# Altium project SPEC_A7_Management.PrjPcb (part 1 of 2)
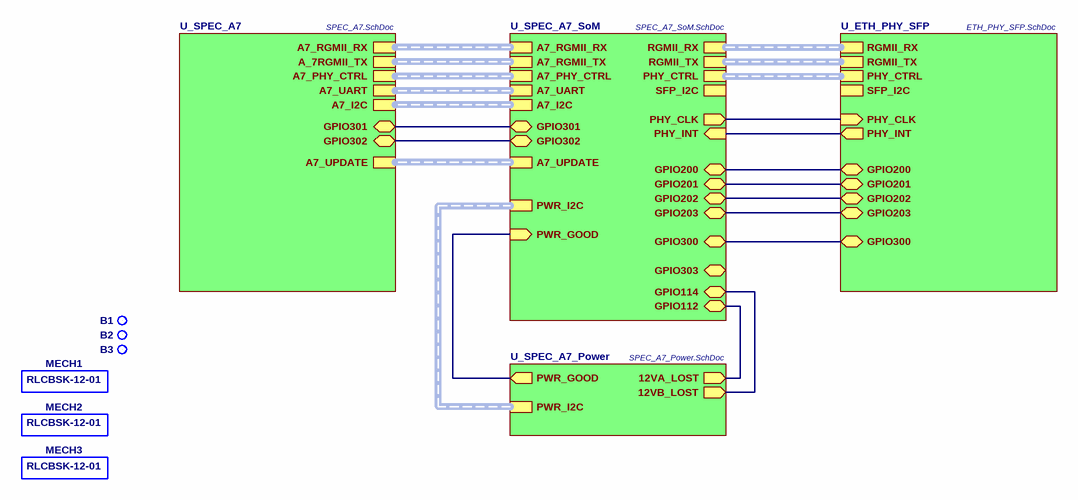
[diagram p0: SPEC_A7_Managment-TOP.SchDoc]
Project: Spec7; Title: Clocker; Title2: Spec7 Managment Unit; Version: v1.0
5 sheets, 180 parts. Net scope: hierarchical (ports join the sheet entries above them; power ports are global).
Board file: SPEC_A7_Management.PCBDOC
Sheets:
  SPEC_A7_Managment-TOP.SchDoc
    U_ETH_PHY_SFP = ETH_PHY_SFP.SchDoc
    U_SPEC_A7 = SPEC_A7.SchDoc
    U_SPEC_A7_Power = SPEC_A7_Power.SchDoc
    U_SPEC_A7_SoM = SPEC_A7_SoM.SchDoc

## Sheet SPEC_A7_Managment-TOP.SchDoc: Clocker
size 420 x 297 mm; DrawnBy: A.B.; Organization: Wydział Elektroniki i Technik Informacyjnych; Address1: ul. Nowowiejska 15/19; Address2: 00-665 Warszawa; Address3: NSW; Address4: Polska; Revision: 0; SheetNumber: 1; SheetTotal: 5; CreateDate: 20/06/2024; Designer: A.B.; Projet: Spec7; CheckedDate: -; ModifiedBy: -

### Parts
B1  Non Plated Hole  [MTG400]  (value not drawn)  (no BOM)
B2  Non Plated Hole  [MTG400]  (value not drawn)  (no BOM)
B3  Non Plated Hole  [MTG400]  (value not drawn)  (no BOM)
MECH1  RLCBSK-12-01  [GENERIC_MECH]
MECH2  RLCBSK-12-01  [GENERIC_MECH]
MECH3  RLCBSK-12-01  [GENERIC_MECH]

### Sub-sheets
U_ETH_PHY_SFP = ETH_PHY_SFP.SchDoc: RGMII_RX (harness RGMII), RGMII_TX (harness RGMII), PHY_CTRL (harness PHY_CTRL), PHY_CLK (in), SFP_I2C (harness I2C), PHY_INT (out), GPIO200 (bidir), GPIO203 (bidir), GPIO201 (bidir), GPIO300 (bidir), GPIO202 (bidir)
U_SPEC_A7 = SPEC_A7.SchDoc: A7_RGMII_RX (harness RGMII), A_7RGMII_TX (harness RGMII), A7_PHY_CTRL (harness PHY_CTRL), A7_I2C (harness I2C), A7_UART (harness UART), GPIO302 (bidir), GPIO301 (bidir), A7_UPDATE (harness FPGA_UPDATE)
U_SPEC_A7_Power = SPEC_A7_Power.SchDoc: PWR_I2C (harness I2C), PWR_GOOD (out), 12VA_LOST (out), 12VB_LOST (out)
U_SPEC_A7_SoM = SPEC_A7_SoM.SchDoc: RGMII_RX (harness RGMII), RGMII_TX (harness RGMII), PHY_CTRL (harness PHY_CTRL), A7_RGMII_RX (harness RGMII), A7_RGMII_TX (harness RGMII), A7_PHY_CTRL (harness PHY_CTRL), PHY_CLK (out), PHY_INT (in), SFP_I2C (harness I2C), PWR_I2C (harness I2C), A7_I2C (harness I2C), A7_UART (harness UART), PWR_GOOD (in), GPIO302 (bidir), GPIO200 (bidir), GPIO303 (bidir), GPIO203 (bidir), GPIO202 (bidir), GPIO201 (bidir), GPIO301 (bidir), GPIO300 (bidir), A7_UPDATE (harness FPGA_UPDATE), GPIO114 (bidir), GPIO112 (bidir)

### Nets
GPIO112: sheet U_SPEC_A7_Power/12VA_LOST, sheet U_SPEC_A7_SoM/GPIO112
GPIO114: sheet U_SPEC_A7_Power/12VB_LOST, sheet U_SPEC_A7_SoM/GPIO114
GPIO200: sheet U_ETH_PHY_SFP/GPIO200, sheet U_SPEC_A7_SoM/GPIO200
GPIO201: sheet U_ETH_PHY_SFP/GPIO201, sheet U_SPEC_A7_SoM/GPIO201
GPIO202: sheet U_ETH_PHY_SFP/GPIO202, sheet U_SPEC_A7_SoM/GPIO202
GPIO203: sheet U_ETH_PHY_SFP/GPIO203, sheet U_SPEC_A7_SoM/GPIO203
GPIO300: sheet U_ETH_PHY_SFP/GPIO300, sheet U_SPEC_A7_SoM/GPIO300
GPIO301: sheet U_SPEC_A7/GPIO302, sheet U_SPEC_A7_SoM/GPIO302
GPIO302: sheet U_SPEC_A7/GPIO301, sheet U_SPEC_A7_SoM/GPIO301
PHY_CLKX: sheet U_ETH_PHY_SFP/PHY_CLK, sheet U_SPEC_A7_SoM/PHY_CLK
PHY_INTn: sheet U_ETH_PHY_SFP/PHY_INT, sheet U_SPEC_A7_SoM/PHY_INT
PWR_GOOD: sheet U_SPEC_A7_Power/PWR_GOOD, sheet U_SPEC_A7_SoM/PWR_GOOD

Not connected (* = marked no-connect by the designer): B1 1; B2 1; B3 1

### Buses and harness runs
harness sheet U_ETH_PHY_SFP/PHY_CTRL = sheet U_SPEC_A7_SoM/PHY_CTRL
harness sheet U_ETH_PHY_SFP/RGMII_RX = sheet U_SPEC_A7_SoM/RGMII_RX
harness sheet U_ETH_PHY_SFP/RGMII_TX = sheet U_SPEC_A7_SoM/RGMII_TX
harness sheet U_SPEC_A7/A7_I2C = sheet U_SPEC_A7_SoM/A7_I2C
harness sheet U_SPEC_A7/A7_PHY_CTRL = sheet U_SPEC_A7_SoM/A7_PHY_CTRL
harness sheet U_SPEC_A7/A7_RGMII_RX = sheet U_SPEC_A7_SoM/A7_RGMII_RX
harness sheet U_SPEC_A7/A7_UART = sheet U_SPEC_A7_SoM/A7_UART
harness sheet U_SPEC_A7/A7_UPDATE = sheet U_SPEC_A7_SoM/A7_UPDATE
harness sheet U_SPEC_A7/A_7RGMII_TX = sheet U_SPEC_A7_SoM/A7_RGMII_TX
harness sheet U_SPEC_A7_Power/PWR_I2C = sheet U_SPEC_A7_SoM/PWR_I2C

### Notes on the sheet
- Project/Equipment
- Document
- Designer
- Drawn by
- Check.by
- Copyright WUT ISE 2024.
  This documentation describes Open Hardware and is licensed under the CERN OHL v.2. You may redistribute and modify this documentation under the terms of the CERN OHL v.2. (http://ohwr.org/CERNOHL). This documentation is distributed WITHOUT ANY EXPRESS OR IMPLIED WARRANTY, INCLUDING OF MERCHANTABILITY, SATISFACTORY QUALITY AND FITNESS FOR A PARTICULAR PURPOSE. Please see the CERN OHL v.2 for applicable conditions.
- Contact
- File
- Last Mod.
- Print Date
- Sheet
- Size
- A3
- of
- Rev

### Library data of the parts
B1-B3 = NON-PLATED_HOLE4.0: Single Terminal Socket; Part Description: Non Plated Through Hole: Hole Dia.=4.0mm; Mounted: No; Part Number: NON-PLATED_HOLE4.0; Component Type: Standard (No BOM); Pin Count: 1; Family: Non Plated Hole; Socket: No; SMD: No; Sense: No; Status: None; ComponentHeight: 0mm; HelpURL: Undefined; Author: CERN DEM JMW; CreateDate: 22.03.2019; LatestRevisionDate: 22.03.2019; PackageDescription: Non Plated Through Hole: Hole Dia.=4.0mm
MECH1-MECH3 = Generic_mechanical: generic; Part Number: Essentra; Part Description: 12mm nylon standoff; PressFit: No; Component Kind: Accessories; Component Type: Standard; Footprint: generic_MECH; Pin Count: 0; PackageDescription: generic; Mounted: Yes; Socket: No; SMD: No; Sense: No; Status: None; Value: RLCBSK-12-01; Manufacturer: Essentra; Manufacturer Part Number: RLCBSK-12-01; ComponentHeight: 12; Author: GK; CreateDate: 28.10.2019; LatestRevisionDate: 28.10.2019

## Sheet ETH_PHY_SFP.SchDoc: Clocker
size 420 x 297 mm; DrawnBy: A.B.; Organization: Wydział Elektroniki i Technik Informacyjnych; Address1: ul. Nowowiejska 15/19; Address2: 00-665 Warszawa; Address3: NSW; Address4: Polska; Revision: 0; SheetNumber: 3; SheetTotal: 5; CreateDate: 20/06/2024; Designer: A.B.; Projet: Spec7; CheckedDate: -; ModifiedBy: -
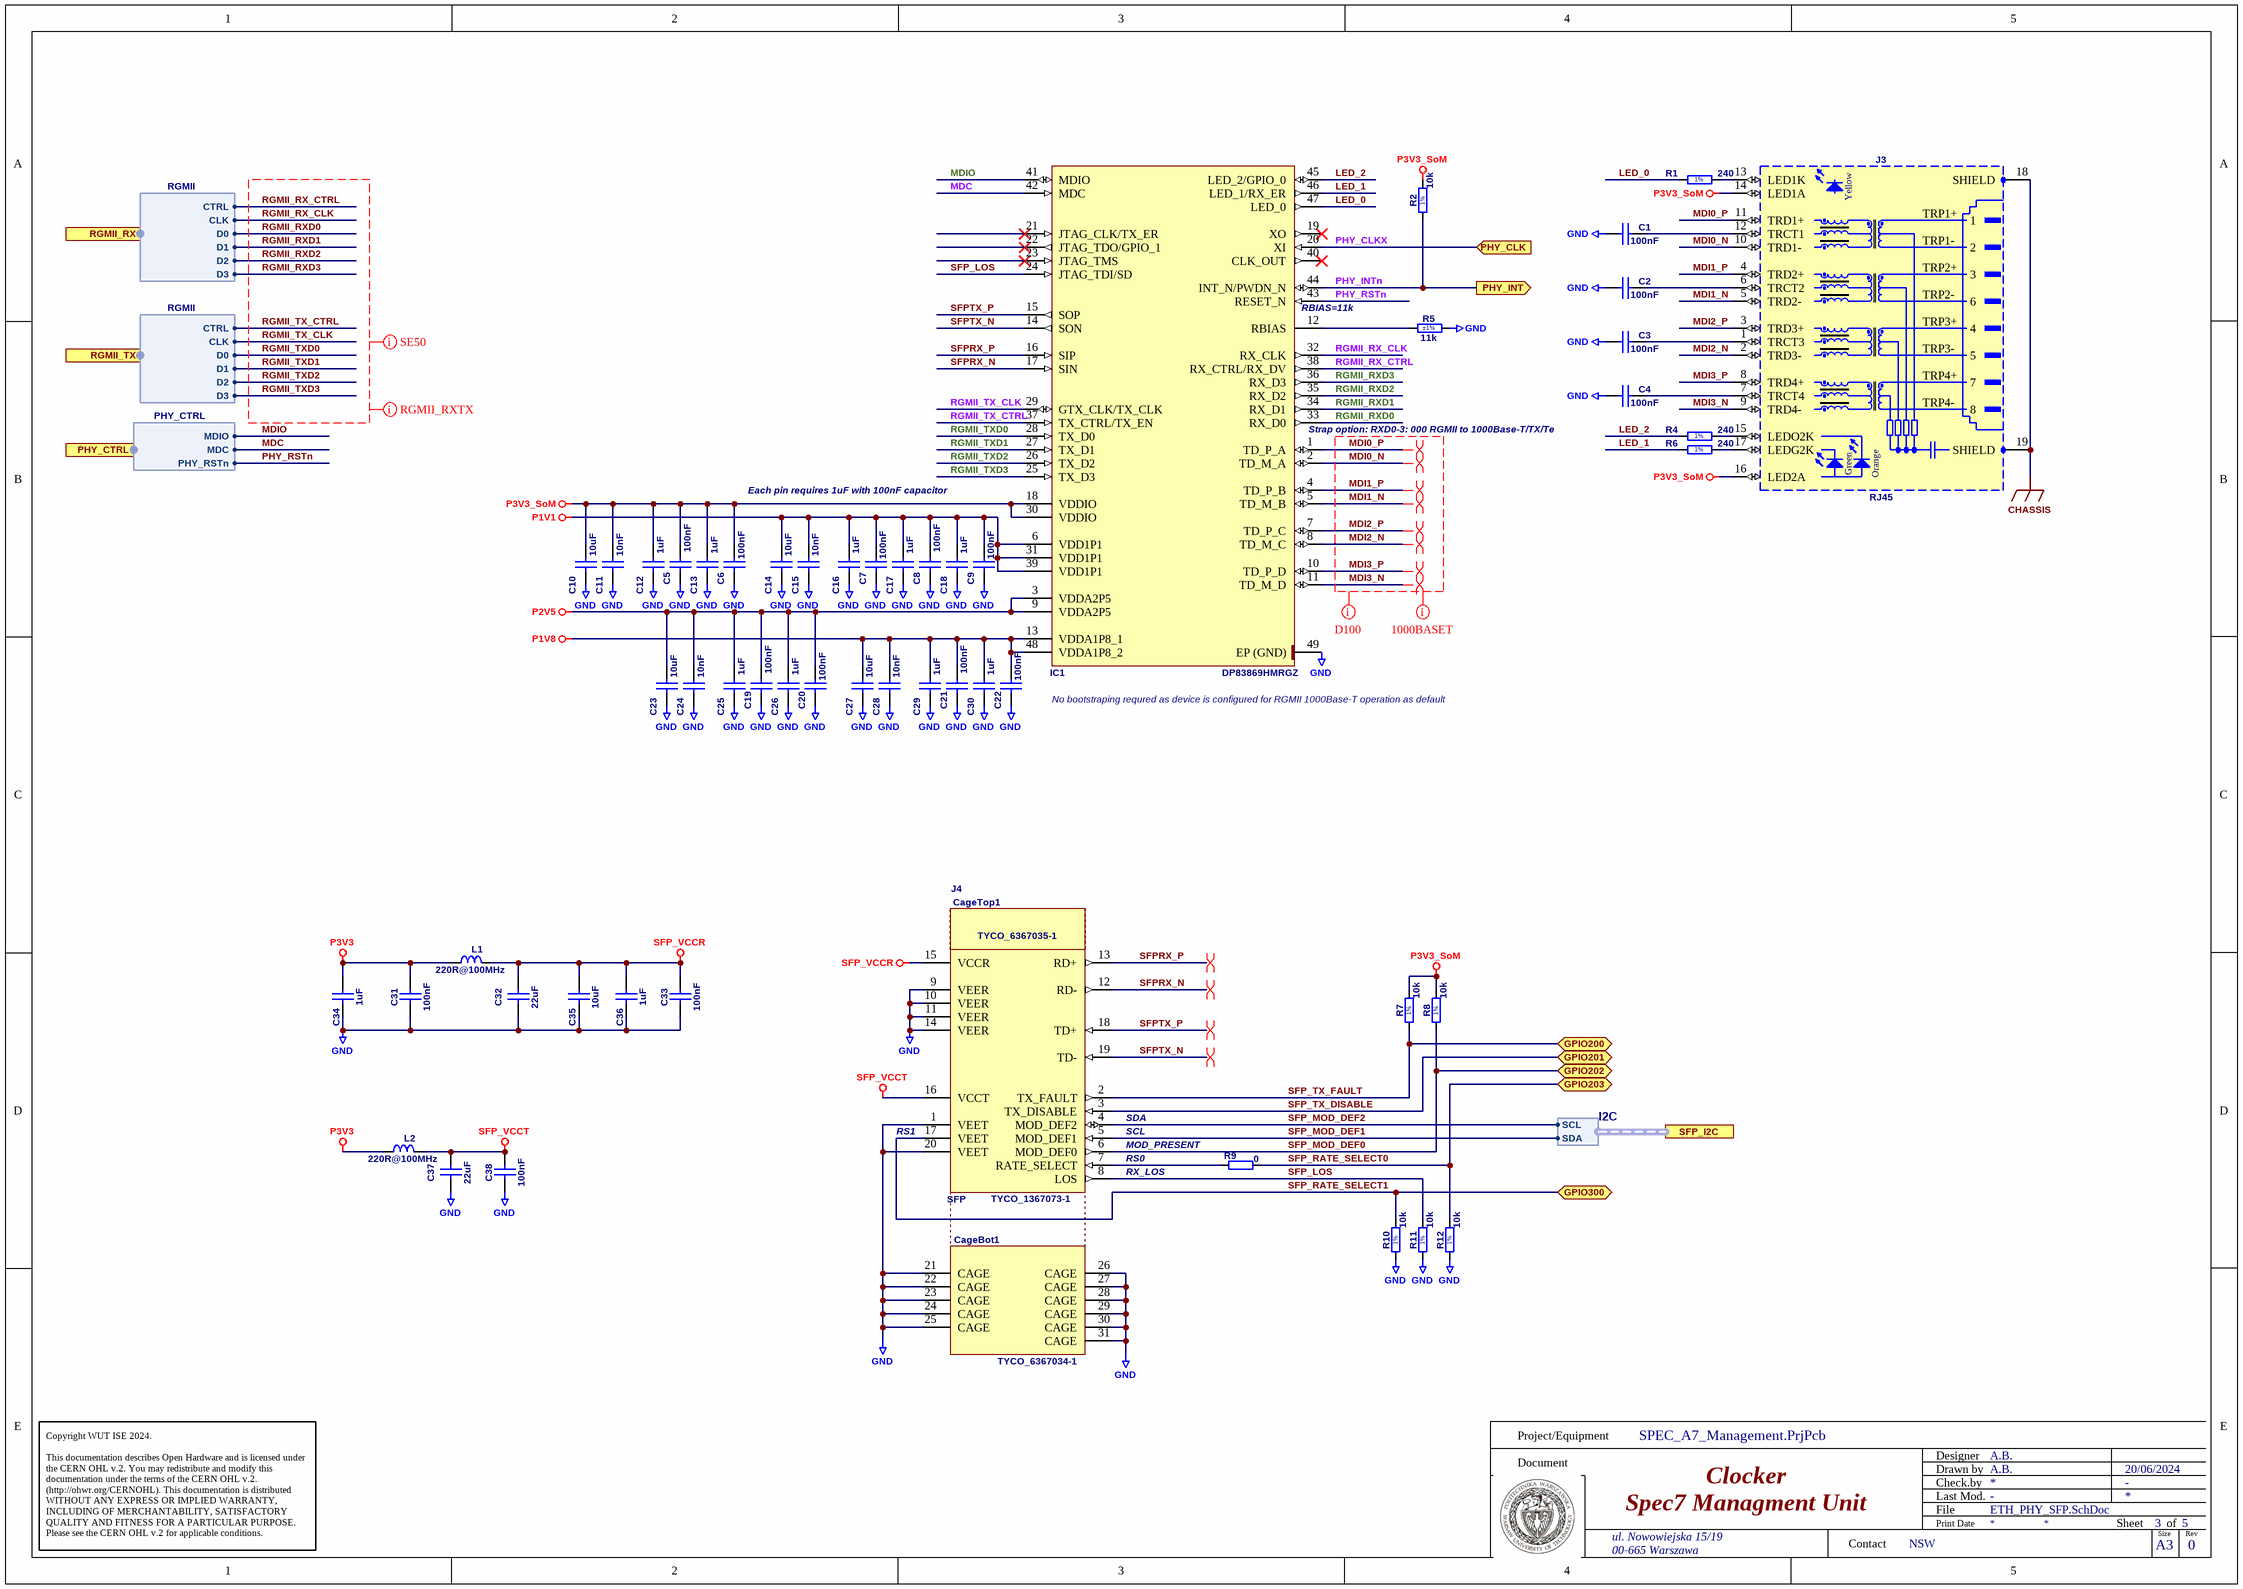
[diagram p1: ETH_PHY_SFP.SchDoc]

### Parts
C1  100nF  [CAPC1005X55N]
C2  100nF  [CAPC1005X55N]
C3  100nF  [CAPC1005X55N]
C4  100nF  [CAPC1005X55N]
C5  100nF  [CAPC1005X55N]
C6  100nF  [CAPC1005X55N]
C7  100nF  [CAPC1005X55N]
C8  100nF  [CAPC1005X55N]
C9  100nF  [CAPC1005X55N]
C10  10uF  [CAPC1608X80N]
C11  10nF  [CAPC1005X55N]
C12  1uF  [CAPC1005X55N]
C13  1uF  [CAPC1005X55N]
C14  10uF  [CAPC1608X80N]
C15  10nF  [CAPC1005X55N]
C16  1uF  [CAPC1005X55N]
C17  1uF  [CAPC1005X55N]
C18  1uF  [CAPC1005X55N]
C19  100nF  [CAPC1005X55N]
C20  100nF  [CAPC1005X55N]
C21  100nF  [CAPC1005X55N]
C22  100nF  [CAPC1005X55N]
C23  10uF  [CAPC1608X80N]
C24  10nF  [CAPC1005X55N]
C25  1uF  [CAPC1005X55N]
C26  1uF  [CAPC1005X55N]
C27  10uF  [CAPC1608X80N]
C28  10nF  [CAPC1005X55N]
C29  1uF  [CAPC1005X55N]
C30  1uF  [CAPC1005X55N]
C31  100nF  [CAPC1005X55N]
C32  22uF  [CAPC2012X135N]
C33  100nF  [CAPC1005X55N]
C34  1uF  [CAPC1005X55N]
C35  10uF  [CAPC1608X80N]
C36  1uF  [CAPC1005X55N]
C37  22uF  [CAPC2012X135N]
C38  100nF  [CAPC1005X55N]
CageBot1  SFP  [TYCO_6367034-1]
CageTop1  SFP  [TYCO_6367035-1]
IC1  DP83869HMRGZ  [QFN50P700X700X100-49N-S420]
J3  RJ45  [BEL_L829-1J1T-43]
J4  SFP  [TYCO_1367073-1]
L1  220R@100MHz  [INDC2012X105N]
L2  220R@100MHz  [INDC2012X105N]
R1  240  [RESC1005X40N]
R2  10k  [RESC1005X40N]
R4  240  [RESC1005X40N]
R5  11k  Tolerance: ±1%  [RESC1005X40N]
R6  240  [RESC1005X40N]
R7  10k  [RESC1005X40N]
R8  10k  [RESC1005X40N]
R9  0  [RESC1005X40N]
R10  10k  [RESC1005X40N]
R11  10k  [RESC1005X40N]
R12  10k  [RESC1005X40N]

### Ports
GPIO200 (bidir), GPIO201 (bidir), GPIO202 (bidir), GPIO203 (bidir), GPIO300 (bidir), PHY_CLK (in), PHY_CTRL (harness PHY_CTRL), PHY_INT (out), RGMII_RX (harness RGMII), RGMII_TX (harness RGMII), SFP_I2C (harness I2C)

### Harnesses
RGMII: CTRL, CLK, D0, D1, D2, D3
PHY_CTRL: MDIO, MDC, PHY_RSTn
I2C: SCL, SDA

### Nets
CHASSIS: J3.18(SHIELD) J3.19(SHIELD)
GND: C1.1 C2.1 C3.1 C4.1 C5.1 C6.1 C7.1 C8.1 C9.1 C10.1 C11.1 C12.1 C13.1 C14.1 C15.1 C16.1 C17.1 C18.1 C19.1 C20.1 C21.1 C22.1 C23.1 C24.1 C25.1 C26.1 C27.1 C28.1 C29.1 C30.1 C31.1 C32.1 C33.1 C34.1 C35.1 C36.1 C37.1 C38.1 CageBot1.21(CAGE) CageBot1.22(CAGE) CageBot1.23(CAGE) CageBot1.24(CAGE) CageBot1.25(CAGE) CageBot1.26(CAGE) CageBot1.27(CAGE) CageBot1.28(CAGE) CageBot1.29(CAGE) CageBot1.30(CAGE) CageBot1.31(CAGE) IC1.49(EP_(GND)) J4.1(VEET) J4.9(VEER) J4.10(VEER) J4.11(VEER) J4.14(VEER) J4.20(VEET) R5.2 R10.1 R11.1 R12.1
P1V1: C7.2 C8.2 C9.2 C14.2 C15.2 C16.2 C17.2 C18.2 IC1.6(VDD1P1) IC1.31(VDD1P1) IC1.39(VDD1P1)
P1V8: C21.2 C22.2 C27.2 C28.2 C29.2 C30.2 IC1.13(VDDA1P8_1) IC1.48(VDDA1P8_2)
P2V5: C19.2 C20.2 C23.2 C24.2 C25.2 C26.2 IC1.3(VDDA2P5) IC1.9(VDDA2P5)
P3V3: C31.2 C34.2 L1.1 L2.1
P3V3_SoM: C5.2 C6.2 C10.2 C11.2 C12.2 C13.2 IC1.18(VDDIO) IC1.30(VDDIO) J3.14(LED1A) J3.16(LED2A) R2.2 R7.2 R8.2
SFP_VCCR: C32.2 C33.2 C35.2 C36.2 J4.15(VCCR) L1.2
SFP_VCCT: C37.2 C38.2 J4.16(VCCT) L2.2
LED_0: IC1.47(LED_0) R1.1
LED_1: IC1.46(LED_1/RX_ER) R6.1
LED_2: IC1.45(LED_2/GPIO_0) R4.1
MDC: IC1.42(MDC) ; port PHY_CTRL.MDC  [project net ENET1_MDC]
MDI0_N: IC1.2(TD_M_A) J3.10(TRD1-)
MDI0_P: IC1.1(TD_P_A) J3.11(TRD1+)
MDI1_N: IC1.5(TD_M_B) J3.5(TRD2-)
MDI1_P: IC1.4(TD_P_B) J3.4(TRD2+)
MDI2_N: IC1.8(TD_M_C) J3.2(TRD3-)
MDI2_P: IC1.7(TD_P_C) J3.3(TRD3+)
MDI3_N: IC1.11(TD_M_D) J3.9(TRD4-)
MDI3_P: IC1.10(TD_P_D) J3.8(TRD4+)
MDIO: IC1.41(MDIO) ; port PHY_CTRL.MDIO  [project net ENET1_MDIO]
PHY_CLKX: IC1.20(XI) ; port PHY_CLK
PHY_INTn: IC1.44(INT_N/PWDN_N) R2.1 ; port PHY_INT
PHY_RSTn: IC1.43(RESET_N) ; port PHY_CTRL.PHY_RSTn  [project net PHY1_RSTn]
RGMII_RX_CLK: IC1.32(RX_CLK) ; port RGMII_RX.CLK  [project net ENET1_RX_CLK]
RGMII_RX_CTRL: IC1.38(RX_CTRL/RX_DV) ; port RGMII_RX.CTRL  [project net ENET1_RX_CTRL]
RGMII_RXD0: IC1.33(RX_D0) ; port RGMII_RX.D0  [project net ENET1_RXD0]
RGMII_RXD1: IC1.34(RX_D1) ; port RGMII_RX.D1  [project net ENET1_RXD1]
RGMII_RXD2: IC1.35(RX_D2) ; port RGMII_RX.D2  [project net ENET1_RXD2]
RGMII_RXD3: IC1.36(RX_D3) ; port RGMII_RX.D3  [project net ENET1_RXD3]
RGMII_TX_CLK: IC1.29(GTX_CLK/TX_CLK) ; port RGMII_TX.CLK  [project net ENET1_TX_CLK]
RGMII_TX_CTRL: IC1.37(TX_CTRL/TX_EN) ; port RGMII_TX.CTRL  [project net ENET1_TX_CTRL]
RGMII_TXD0: IC1.28(TX_D0) ; port RGMII_TX.D0  [project net ENET1_TXD0]
RGMII_TXD1: IC1.27(TX_D1) ; port RGMII_TX.D1  [project net ENET1_TXD1]
RGMII_TXD2: IC1.26(TX_D2) ; port RGMII_TX.D2  [project net ENET1_TXD2]
RGMII_TXD3: IC1.25(TX_D3) ; port RGMII_TX.D3  [project net ENET1_TXD3]
SFP_LOS: IC1.24(JTAG_TDI/SD) J4.8(LOS) R11.2
SFP_MOD_DEF0: J4.6(MOD_DEF0) R8.1 ; port GPIO202  [project net GPIO202]
SFP_MOD_DEF1: J4.5(MOD_DEF1) ; port SFP_I2C.SDA
SFP_MOD_DEF2: J4.4(MOD_DEF2) ; port SFP_I2C.SCL
SFP_RATE_SELECT0: R9.2 R12.2 ; port GPIO203  [project net GPIO203]
SFP_RATE_SELECT1: J4.17(VEET) R10.2 ; port GPIO300  [project net GPIO300]
SFP_TX_DISABLE: J4.3(TX_DISABLE) ; port GPIO201  [project net GPIO201]
SFP_TX_FAULT: J4.2(TX_FAULT) R7.1 ; port GPIO200  [project net GPIO200]
SFPRX_N: IC1.17(SIN) J4.12(RD-)
SFPRX_P: IC1.16(SIP) J4.13(RD+)
SFPTX_N: IC1.14(SON) J4.19(TD-)
SFPTX_P: IC1.15(SOP) J4.18(TD+)
NetC1_2: C1.2 J3.12(TRCT1)
NetC2_2: C2.2 J3.6(TRCT2)
NetC3_2: C3.2 J3.1(TRCT3)
NetC4_2: C4.2 J3.7(TRCT4)
NetIC1_12: IC1.12(RBIAS) R5.1
NetJ3_13: J3.13(LED1K) R1.2
NetJ3_15: J3.15(LEDO2K) R4.2
NetJ3_17: J3.17(LEDG2K) R6.2
NetJ4_7: J4.7(RATE_SELECT) R9.1

Not connected (* = marked no-connect by the designer): IC1 19(XO)* 21(JTAG_CLK/TX_ER)* 22(JTAG_TDO/GPIO_1)* 23(JTAG_TMS)* 40(CLK_OUT)*

### Layout directives
net class RGMII_RXTX: RGMII_RX_CLK, RGMII_RX_CTRL, RGMII_RXD0, RGMII_RXD1, RGMII_RXD2, RGMII_RXD3, RGMII_TX_CLK, RGMII_TX_CTRL, RGMII_TXD0, RGMII_TXD1, RGMII_TXD2, RGMII_TXD3
net class SE50: RGMII_RX_CLK, RGMII_RX_CTRL, RGMII_RXD0, RGMII_RXD1, RGMII_RXD2, RGMII_RXD3, RGMII_TX_CLK, RGMII_TX_CTRL, RGMII_TXD0, RGMII_TXD1, RGMII_TXD2, RGMII_TXD3
differential pair: MDI0_N, MDI0_P, MDI1_N, MDI1_P, MDI2_N, MDI2_P, MDI3_N, MDI3_P, SFPRX_N, SFPRX_P, SFPTX_N, SFPTX_P
net class D100: MDI0_N, MDI0_P, MDI1_N, MDI1_P, MDI2_N, MDI2_P, MDI3_N, MDI3_P
net class 1000BASET: MDI0_N, MDI0_P, MDI1_N, MDI1_P, MDI2_N, MDI2_P, MDI3_N, MDI3_P

### Notes on the sheet
- (near IC1) RBIAS=11k
- (near IC1) Strap option: RXD0-3: 000 RGMII to 1000Base-T/TX/Te
- Each pin requires 1uF with 100nF capacitor
- No bootstraping requred as device is configured for RGMII 1000Base-T operation as default
- (near J4) RS1
- (near J4) SDA
- (near J4) SCL
- MOD_PRESENT
- (near J4) RS0
- (near J4) RX_LOS
- Project/Equipment
- Document
- Designer
- Drawn by
- Check.by
- Copyright WUT ISE 2024.
  This documentation describes Open Hardware and is licensed under the CERN OHL v.2. You may redistribute and modify this documentation under the terms of the CERN OHL v.2. (http://ohwr.org/CERNOHL). This documentation is distributed WITHOUT ANY EXPRESS OR IMPLIED WARRANTY, INCLUDING OF MERCHANTABILITY, SATISFACTORY QUALITY AND FITNESS FOR A PARTICULAR PURPOSE. Please see the CERN OHL v.2 for applicable conditions.
- Contact
- File
- Last Mod.
- Print Date
- Sheet
- Size
- A3
- of
- Rev
- (in symbol BELFUSE_L829-1J1T-43) Yellow; TRP1+; TRP1-; TRP2+; TRP2-; TRP3+; TRP3-; TRP4+; TRP4-; Green; Orange
- (in symbol R0402_10K_1%_0.0625W_100PPM) 1%
- (in symbol R0402_240R_1%_0.0625W_100PPM) 1%
- (in symbol TYCO_1367073-1) Add Cage Top Here; (Ex: TYCO_6367035-1); Add Cage Bottom Here; (Ex: TYCO_6367034-1)

### Library data of the parts
C1-C9 C19-C22 C31 C33 C38 = CC0402_100NF_16V_10%_X7R: Non-polarised capacitor; Part Description: SMD Multilayer Chip Ceramic Capacitor; Manufacturer: GENERIC; Manufacturer1 Part Number: GRM155R71C104KA88D; Voltage: 16V; TC: X7R; Tolerance: ±10%; Part Number: CC0402_100NF_16V_10%_X7R; Component Kind: Standard; Component Type: Standard; Pin Count: 2; Value: 100nF; Status: Not Recommended; Manufacturer Part Number: CC0402_100NF_16V_10%_X7R; Case: 0402; Mounted: Yes; Socket: No; SMD: Yes; Sense: No; Manufacturer1 Example: MURATA; Manufacturer1 ComponentHeight: 0.55mm; HelpURL: \\cern.ch\dfs\Applications\Altium\Datasheets\CC0402_X7R_MURATA_GRM.pdf; Author: CERN DEM JLC; CreateDate: 05/12/2013; LatestRevisionDate: 03/12/2007
C10 C14 C23 C27 C35 = CC0603_10UF_16V_20%_X5R: Non-polarised capacitor; Part Description: SMD Multilayer Chip Ceramic Capacitor; Manufacturer: GENERIC; Manufacturer1 Part Number: GRM188R61C106MA73D; Voltage: 16V; TC: X5R; Tolerance: ±20%; Part Number: CC0603_10UF_16V_20%_X5R; Component Kind: Standard; Component Type: Standard; Pin Count: 2; Value: 10uF; Status: None; Manufacturer Part Number: CC0603_10UF_16V_20%_X5R; Case: 0603; Mounted: Yes; Socket: No; SMD: Yes; Sense: No; Manufacturer1 Example: MURATA; Manufacturer1 ComponentHeight: 0.8mm; HelpURL: \\cern.ch\dfs\Applications\Altium\Datasheets\CC0603_X5R_MURATA_GRM.pdf; Author: CERN DEM MR; CreateDate: 02.03.2016; LatestRevisionDate: 02.03.2016
C11 C15 C24 C28 = CC0402_10NF_16V_10%_X7R: Non-polarised capacitor; Part Description: SMD Multilayer Chip Ceramic Capacitor; Manufacturer: GENERIC; Manufacturer1 Part Number: 223878715636; Voltage: 16V; TC: X7R; Tolerance: ±10%; Part Number: CC0402_10NF_16V_10%_X7R; Component Kind: Standard; Component Type: Standard; Pin Count: 2; Value: 10nF; Status: Not Recommended; Manufacturer Part Number: CC0402_10NF_16V_10%_X7R; Case: 0402; Mounted: Yes; Socket: No; SMD: Yes; Sense: No; Manufacturer1 Example: PHYCOMP; Manufacturer1 ComponentHeight: 0.55mm; HelpURL: \\cern.ch\dfs\Applications\Altium\Datasheets\CC0402_X7R_PHYCOMP.pdf; Author: CERN DEM JLC; CreateDate: 03.12.2007; LatestRevisionDate: 03.12.2007
C12 C13 C16-C18 C25 C26 C29 C30 C34 C36 = CC0402_1UF_16V_10%_X5R: Non-polarised capacitor; Part Description: SMD Multilayer Chip Ceramic Capacitor; Manufacturer: GENERIC; Manufacturer1 Part Number: C1005X5R1C105KT; Voltage: 16V; TC: X5R; Tolerance: ±10%; Part Number: CC0402_1UF_16V_10%_X5R; Component Kind: Standard; Component Type: Standard; Pin Count: 2; Value: 1uF; Status: Preferred; Manufacturer Part Number: CC0402_1UF_16V_10%_X5R; Case: 0402; Mounted: Yes; Socket: No; SMD: Yes; Sense: No; Manufacturer1 Example: TDK; Manufacturer1 ComponentHeight: 0.55mm; HelpURL: \\cern.ch\dfs\Applications\Altium\Datasheets\CC0402_X5R_TDK_C.pdf; Author: CERN DEM JLC; CreateDate: 2012-10-25; LatestRevisionDate: 2012-10-25
C32 C37 = CC0805_22UF_16V_10%_X5R: Non-polarised capacitor; Manufacturer: GENERIC; Part Description: SMD Multilayer Chip Ceramic Capacitor; Manufacturer1 Part Number: C2012X5R1C226KT; Tolerance: ±10%; Voltage: 16V; TC: X5R; Manufacturer Part Number: CC0805_22UF_16V_10%_X5R; Part Number: CC0805_22UF_16V_10%_X5R; Value: 22uF; Component Kind: Standard; Component Type: Standard; Pin Count: 2; Status: Preferred; Case: 0805; Mounted: Yes; Socket: No; SMD: Yes; Sense: No; Manufacturer1 Example: TDK; Manufacturer1 ComponentHeight: 1.35mm; HelpURL: \\cern.ch\dfs\Applications\Altium\Datasheets\CC0805_X5R_TDK_C.pdf; Author: CERN DEM JLC; CreateDate: 25.10.2012; LatestRevisionDate: 25.10.2012
CageBot1 = TYCO_6367034-1: SFP  Cage Bottom (Small Form-factor Pluggable); Part Description: Cage bottom For Single Port SFP  (Small Form-factor Pluggable); Manufacturer: TYCO ELECTRONICS; Table: TYCO; Part Number: TYCO_6367034-1; Component Kind: Standard; Component Type: Standard; Pin Count: 11; Family: SFP; Mounted: Yes; Socket: No; SMD: No; Status: None; Manufacturer Part Number: TYCO_6367034-1; ComponentHeight: 8.8mm; ComponentLink1URL: \\cern.ch\dfs\Applications\Altium\Datasheets\TYCO_SFP_Application.pdf; ComponentLink1Description: Application; ComponentLink2URL: \\cern.ch\dfs\Applications\Altium\Datasheets\Tyco_SFP_Specification.pdf; ComponentLink2Description: SFP Specification; HelpURL: \\cern.ch\dfs\Applications\Altium\Datasheets\TYCO_6367034-1.pdf; Author: CERN DEM JLC; CreateDate: 25.01.2010; LatestRevisionDate: 25.01.2010; ClassName: Component_Not_DRC
CageTop1 = TYCO_6367035-1: SFP  Cage Top (Small Form-factor Pluggable); Part Description: Cage Top For Single Port SFP  (Small Form-factor Pluggable); Manufacturer: TYCO ELECTRONICS; Table: TYCO; Part Number: TYCO_6367035-1; Component Kind: Standard; Component Type: Standard; Designator: SFPx1_Cage Top; Library Reference: SFPx1_Cage Top; Pin Count: 0; Family: SFP; Mounted: Yes; Socket: No; SMD: No; Status: None; Manufacturer Part Number: TYCO_6367035-1; ComponentHeight: 10mm; Datasheet: \\cern.ch\dfs\Applications\Altium\Datasheets\TYCO_6367035-1.pdf; ComponentLink1URL: \\cern.ch\dfs\Applications\Altium\Datasheets\TYCO_SFP_Application.pdf; ComponentLink1Description: Application; ComponentLink2URL: \\cern.ch\dfs\Applications\Altium\Datasheets\Tyco_SFP_Specification.pdf; ComponentLink2Description: SFP Specification; HelpURL: \\cern.ch\dfs\Applications\Altium\Datasheets\TYCO_6367035-1.pdf; Author: CERN DEM JLC; CreateDate: 25/01/2010; LatestRevisionDate: 25/01/2010; ClassName: Component_Not_DRC
IC1 = DP83869HMRGZ: DP83869HM High Immunity 10/100/1000 Ethernet Physical Layer Transceiver WithCopper and Fiber Interface; Manufacturer: TEXAS INSTRUMENTS; PressFit: No; Bonding: No; Part Number: DP83869HMRGZ; Component Kind: Standard; Component Type: Standard; Device: DP83869HMRGZ; PackageDescription: QFN, 0.50mm Pitch, Square; 48 Pin, 7.00mm L X 7.00mm W X 1.00mm H body (w/Thermal Tab 4.20 X 4.20mm), IPC Medium Density; Part Description: High Immunity 10/100/1000 Ethernet Physical Layer Transceiver with Copper and Fiber Interface; Manufacturer Part Number: DP83869HMRGZ; Pin Count: 48; Case: QFN48; Mounted: Yes; Socket: No; SMD: Yes; Sense: No; ComponentHeight: 1mm; Author: CERN DEM HF; HelpURL: \\cern.ch\dfs\Applications\Altium\Datasheets\DP83869HMRGZ.pdf; CreateDate: 24.04.2024; LatestRevisionDate: 24.04.2024
J3 = BELFUSE_L829-1J1T-43: 1 Port, RJ45, Gigabit Ethernet, MagJack Connector Module With Yellow And Green/Orange LEDs; Part Description: 1 Port, Yellow/ Green-Orange LEDs,  RJ45 10/100/1000 Gigabit Ethernet, MagJack® Connector Module; Manufacturer: BEL MAGNETIC SOLUTIONS; PressFit: No; Part Number: BELFUSE_L829-1J1T-43; Component Kind: Standard; Component Type: Standard; Pin Count: 19; Family: RJ45; Mounted: Yes; Socket: No; SMD: No; Sense: No; Status: None; Manufacturer Part Number: L829-1J1T-43; ComponentHeight: 13.3mm; HelpURL: \\cern.ch\dfs\Applications\Altium\Datasheets\BEL_L829-1J1T-43.pdf; Author: CERN DEM JLC; CreateDate: 22.08.2011; LatestRevisionDate: 20.09.2018
J4 = TYCO_1367073-1: 20 Position SFP  Connector (Small Form-factor Pluggable); Part Description: 20 Position, Pitch 0.8mm SFP  Receptacle (Small Form-factor Pluggable); Manufacturer: TYCO ELECTRONICS; Table: TYCO; Part Number: TYCO_1367073-1; Component Kind: Standard; Component Type: Standard; Pin Count: 20; Family: SFP; Mounted: Yes; Socket: No; SMD: Yes; Status: None; Manufacturer Part Number: 1367073-1; ComponentHeight: 5.4mm; ComponentLink1URL: \\cern.ch\dfs\Applications\Altium\Datasheets\TYCO_SFP_Application.pdf; ComponentLink1Description: Application; ComponentLink2URL: \\cern.ch\dfs\Applications\Altium\Datasheets\Tyco_SFP_Specification.pdf; ComponentLink2Description: SFP Specification; HelpURL: \\cern.ch\dfs\Applications\Altium\Datasheets\TYCO_1367073-1.pdf; Author: CERN DEM JLC; CreateDate: 25/01/2010; LatestRevisionDate: 25/01/2010
L1 L2 = IND0805_MURATA_BLM21PG221SN1D: Inductor; Part Description: SMD EMIFIL Suppression Chip Bead Ferrite; Manufacturer: MURATA; Power: 2A; Resistance: 0.05R; Tolerance: ±25%; Table: Inductors SMD; Part Number: IND0805_MURATA_BLM21PG221SN1D; Component Kind: Standard; Component Type: Standard; Pin Count: 2; Value: 220R@100MHz; Status: None; Manufacturer Part Number: BLM21PG221SN1D; Case: 0805; Mounted: Yes; Socket: No; SMD: Yes; ComponentHeight: 1.05mm; HelpURL: \\cern.ch\dfs\Applications\Altium\Datasheets\IND0402_MURATA_BLM21P.pdf; Author: CERN DEM JLC; CreateDate: 25/01/2010; LatestRevisionDate: 25/01/2010
R1 R4 R6 = R0402_240R_1%_0.0625W_100PPM: Resistor - 1%; Part Description: General Purpose Thick Film Chip Resistor; Manufacturer: GENERIC; Manufacturer1 Part Number: 232270672401L; TC: ±100ppm/°C; PressFit: No; Part Number: R0402_240R_1%_0.0625W_100PPM; Component Kind: Standard; Component Type: Standard; Pin Count: 2; Value: 240; Status: Not Recommended; Power: 0.0625W; Tolerance: ±1%; Manufacturer Part Number: R0402_240R_1%_0.0625W_100PPM; Case: 0402; Mounted: Yes; Sense: No; Socket: No; SMD: Yes; Manufacturer1 Example: YAGEO PHYCOMP; Manufacturer1 ComponentHeight: 0.4mm; HelpURL: \\cern.ch\dfs\Applications\Altium\Datasheets\R0402_Phycomp_RC0402.pdf; Author: CERN DEM JLC; CreateDate: 03.12.2007; LatestRevisionDate: 17.10.2012
R2 R7 R8 R10-R12 = R0402_10K_1%_0.0625W_100PPM: Resistor - 1%; Part Description: General Purpose Thick Film Chip Resistor; Manufacturer: GENERIC; Manufacturer1 Part Number: 232270671003L; TC: ±100ppm/°C; PressFit: No; Part Number: R0402_10K_1%_0.0625W_100PPM; Component Kind: Standard; Component Type: Standard; Pin Count: 2; Value: 10k; Status: Not Recommended; Power: 0.0625W; Tolerance: ±1%; Manufacturer Part Number: R0402_10K_1%_0.0625W_100PPM; Case: 0402; Mounted: Yes; Sense: No; Socket: No; SMD: Yes; Manufacturer1 Example: YAGEO PHYCOMP; Manufacturer1 ComponentHeight: 0.4mm; HelpURL: \\cern.ch\dfs\Applications\Altium\Datasheets\R0402_Phycomp_RC0402.pdf; Author: CERN DEM JLC; CreateDate: 03.12.2007; LatestRevisionDate: 17.10.2012
R5 = R0402_11K_1%_0.0625W_100PPM: Resistor - 1%; Part Description: General Purpose Thick Film Chip Resistor; Manufacturer: GENERIC; Manufacturer1 Part Number: 232270671103L; TC: ±100ppm/°C; PressFit: No; Part Number: R0402_11K_1%_0.0625W_100PPM; Component Kind: Standard; Component Type: Standard; Pin Count: 2; Value: 11k; Status: Not Recommended; Power: 0.0625W; Manufacturer Part Number: R0402_11K_1%_0.0625W_100PPM; Case: 0402; Mounted: Yes; Sense: No; Socket: No; SMD: Yes; Manufacturer1 Example: YAGEO PHYCOMP; Manufacturer1 ComponentHeight: 0.4mm; HelpURL: \\cern.ch\dfs\Applications\Altium\Datasheets\R0402_Phycomp_RC0402.pdf; Author: CERN DEM JLC; CreateDate: 03.12.2007; LatestRevisionDate: 17.10.2012
R9 = R0402_0R_JUMPER: Resistor; Part Description: 1A (0.05R Max DC Resistance) Zero Ohm Jumper; Manufacturer: GENERIC; Manufacturer1 Part Number: 232270591001L; PressFit: No; Part Number: R0402_0R_JUMPER; Component Kind: Standard; Component Type: Standard; Pin Count: 2; Value: 0; Status: Not Recommended; Manufacturer Part Number: R0402_0R_JUMPER; Case: 0402; Mounted: Yes; Sense: No; Socket: No; SMD: Yes; Manufacturer1 Example: YAGEO PHYCOMP; Manufacturer1 ComponentHeight: 0.4mm; HelpURL: \\cern.ch\dfs\Applications\Altium\Datasheets\R0402_Phycomp_RC0402.pdf; Author: CERN DEM JLC; CreateDate: 03.12.2007; LatestRevisionDate: 17.10.2012

## Sheet SPEC_A7.SchDoc: Clocker
size 420 x 297 mm; EDA_Number: ARTIQ; ModifiedBy: -; CreateDate: 20/06/2024; CheckedDate: -; DivGrp: ISE; Designer: A.B.; Projet: Spec7; DrawnBy: A.B.; Organization: Wydział Elektroniki i Technik Informacyjnych; Address1: ul. Nowowiejska 15/19; Address2: 00-665 Warszawa; Address3: NSW; Address4: Polska; Revision: 0; SheetNumber: 2; SheetTotal: 5
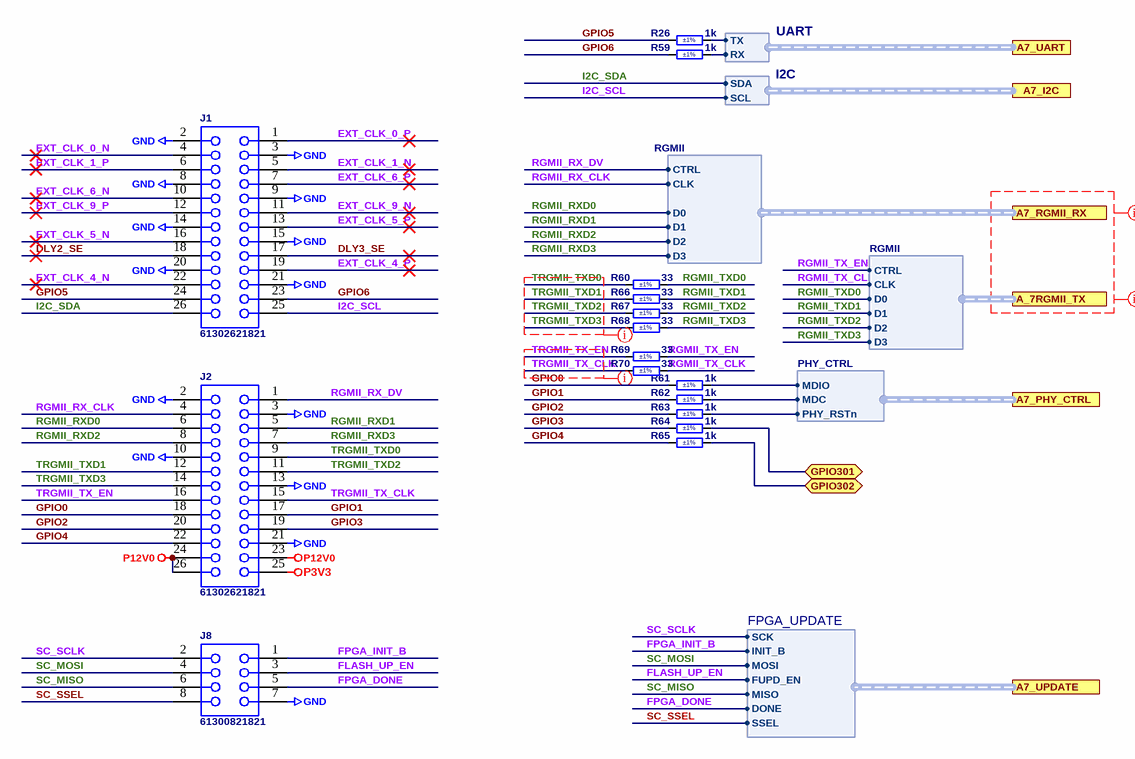
[diagram p2: SPEC_A7.SchDoc]

### Parts
J1  61302621821  [61302621821]
J2  61302621821  [61302621821]
J8  61300821821  [61300821821]
R26  1k  Tolerance: ±1%  [RESC1005X40N]
R59  1k  Tolerance: ±1%  [RESC1005X40N]
R60  33  Tolerance: ±1%  [RESC1005X40N]
R61  1k  Tolerance: ±1%  [RESC1005X40N]
R62  1k  Tolerance: ±1%  [RESC1005X40N]
R63  1k  Tolerance: ±1%  [RESC1005X40N]
R64  1k  Tolerance: ±1%  [RESC1005X40N]
R65  1k  Tolerance: ±1%  [RESC1005X40N]
R66  33  Tolerance: ±1%  [RESC1005X40N]
R67  33  Tolerance: ±1%  [RESC1005X40N]
R68  33  Tolerance: ±1%  [RESC1005X40N]
R69  33  Tolerance: ±1%  [RESC1005X40N]
R70  33  Tolerance: ±1%  [RESC1005X40N]

### Ports
A7_I2C (harness I2C), A7_PHY_CTRL (harness PHY_CTRL), A7_RGMII_RX (harness RGMII), A7_UART (harness UART), A7_UPDATE (harness FPGA_UPDATE), A_7RGMII_TX (harness RGMII), GPIO301 (bidir), GPIO302 (bidir)

### Harnesses
RGMII: CTRL, CLK, D0, D1, D2, D3
PHY_CTRL: MDIO, MDC, PHY_RSTn
I2C: SCL, SDA
UART: TX, RX
FPGA_UPDATE: SCK, INIT_B, MOSI, FUPD_EN, MISO, DONE, SSEL

### Nets
GND: J1.2 J1.3 J1.8 J1.9 J1.14 J1.15 J1.20 J1.21 J2.2 J2.3 J2.10 J2.13 J2.21 J8.7
P3V3: J2.25
P12V0: J2.23 J2.24 J2.26
A7_RXD: R59.2 ; port A7_UART.RX
A7_TXD: R26.2 ; port A7_UART.TX
DLY2_SE: J1.18
DLY3_SE: J1.17
ENET2_MDC: R62.2 ; port A7_PHY_CTRL.MDC
ENET2_MDIO: R61.2 ; port A7_PHY_CTRL.MDIO
EXT_CLK_0_N: J1.4
EXT_CLK_0_P: J1.1
EXT_CLK_1_N: J1.5
EXT_CLK_1_P: J1.6
EXT_CLK_4_N: J1.22
EXT_CLK_4_P: J1.19
EXT_CLK_5_N: J1.16
EXT_CLK_5_P: J1.13
EXT_CLK_6_N: J1.10
EXT_CLK_6_P: J1.7
EXT_CLK_9_N: J1.11
EXT_CLK_9_P: J1.12
FLASH_UP_EN: J8.3 ; port A7_UPDATE.FUPD_EN
FPGA_DONE: J8.5 ; port A7_UPDATE.DONE
FPGA_INIT_B: J8.1 ; port A7_UPDATE.INIT_B
GPIO0: J2.18 R61.1
GPIO1: J2.17 R62.1
GPIO2: J2.20 R63.1
GPIO3: J2.19 R64.1
GPIO4: J2.22 R65.1
GPIO5: J1.24 R26.1
GPIO6: J1.23 R59.1
GPIO301: R65.2 ; port GPIO302
GPIO302: R64.2 ; port GPIO301
I2C_SCL: J1.25 ; port A7_I2C.SCL
I2C_SDA: J1.26 ; port A7_I2C.SDA
PHYX_RSTn: R63.2 ; port A7_PHY_CTRL.PHY_RSTn
RGMII_RX_CLK: J2.4 ; port A7_RGMII_RX.CLK  [project net ENET2_RX_CLK]
RGMII_RX_DV: J2.1 ; port A7_RGMII_RX.CTRL  [project net ENET2_RX_CTRL]
RGMII_RXD0: J2.6 ; port A7_RGMII_RX.D0  [project net ENET2_RXD0]
RGMII_RXD1: J2.5 ; port A7_RGMII_RX.D1  [project net ENET2_RXD1]
RGMII_RXD2: J2.8 ; port A7_RGMII_RX.D2  [project net ENET2_RXD2]
RGMII_RXD3: J2.7 ; port A7_RGMII_RX.D3  [project net ENET2_RXD3]
RGMII_TX_CLK: R70.2 ; port A_7RGMII_TX.CLK  [project net ENET2_TX_CLK]
RGMII_TX_EN: R69.2 ; port A_7RGMII_TX.CTRL  [project net ENET2_TX_CTRL]
RGMII_TXD0: R60.2 ; port A_7RGMII_TX.D0  [project net ENET2_TXD0]
RGMII_TXD1: R66.2 ; port A_7RGMII_TX.D1  [project net ENET2_TXD1]
RGMII_TXD2: R67.2 ; port A_7RGMII_TX.D2  [project net ENET2_TXD2]
RGMII_TXD3: R68.2 ; port A_7RGMII_TX.D3  [project net ENET2_TXD3]
SC_MISO: J8.6 ; port A7_UPDATE.MISO
SC_MOSI: J8.4 ; port A7_UPDATE.MOSI
SC_SCLK: J8.2 ; port A7_UPDATE.SCK
SC_SSEL: J8.8 ; port A7_UPDATE.SSEL
TRGMII_TX_CLK: J2.15 R70.1
TRGMII_TX_EN: J2.16 R69.1
TRGMII_TXD0: J2.9 R60.1
TRGMII_TXD1: J2.12 R66.1
TRGMII_TXD2: J2.11 R67.1
TRGMII_TXD3: J2.14 R68.1

### Layout directives
net class FPGA_RGMII_RXTX: (no net found under the mark)
net class SE50: (no net found under the mark), TRGMII_TX_CLK, TRGMII_TX_EN, TRGMII_TXD0, TRGMII_TXD1, TRGMII_TXD2, TRGMII_TXD3

### Notes on the sheet
- Project/Equipment
- Document
- Designer
- Drawn by
- Check.by
- Copyright WUT ISE 2024.
  This documentation describes Open Hardware and is licensed under the CERN OHL v.2. You may redistribute and modify this documentation under the terms of the CERN OHL v.2. (http://ohwr.org/CERNOHL). This documentation is distributed WITHOUT ANY EXPRESS OR IMPLIED WARRANTY, INCLUDING OF MERCHANTABILITY, SATISFACTORY QUALITY AND FITNESS FOR A PARTICULAR PURPOSE. Please see the CERN OHL v.2 for applicable conditions.
- Contact
- File
- Last Mod.
- Print Date
- Sheet
- Size
- A3
- of
- Rev

### Library data of the parts
J1 J2 = 61302621821: WR-PHD Socket Header, THT, Vertical, pitch 2.54mm, 2 Row, 26P; Manufacturer: Wurth Elektronik; Contact Resistance: 20mOhm; Rated Current: 3A; Working Voltage: 250V; Withstanding Voltage: 500V; Manufacturer Part Number: 61302621821; Category: Board-to-Board Connectors; Match Code: WR-PHD; ComponentLink1Description: Website Link; ComponentLink1URL: https://www.we-online.com/redexpert/article/61302621821?ad; ComponentLink2Description: Datasheet Link; ComponentLink2URL: https://www.we-online.com/redexpert/spec/61302621821?ad; Mount: Through Hole; Operating Temperature Max: 125°C; Operating Temperature Min: -40°C; Packaging: Tray; Gender: Socket Header; Number of Pins: 26; Number of Rows: 2; Orientation: Vertical; Pitch: 2.54mm
J8 = 61300821821: WR-PHD Socket Header, THT, Vertical, pitch 2.54mm, 2 Row, 8P; Manufacturer: Wurth Elektronik; Contact Resistance: 20mOhm; Rated Current: 3A; Working Voltage: 250V; Withstanding Voltage: 500V; Manufacturer Part Number: 61300821821; Category: Board-to-Board Connectors; Match Code: WR-PHD; ComponentLink1Description: Website Link; ComponentLink1URL: https://www.we-online.com/redexpert/article/61300821821?ad; ComponentLink2Description: Datasheet Link; ComponentLink2URL: https://www.we-online.com/redexpert/spec/61300821821?ad; Mount: Through Hole; Operating Temperature Max: 125°C; Operating Temperature Min: -40°C; Packaging: Tray; Gender: Socket Header; Number of Pins: 8; Number of Rows: 2; Orientation: Vertical; Pitch: 2.54mm
R26 R59 R61-R65 = R0402_1K_1%_0.0625W_100PPM: Resistor - 1%; Part Description: General Purpose Thick Film Chip Resistor; Manufacturer: GENERIC; Manufacturer1 Part Number: 232270671002L; TC: ±100ppm/°C; PressFit: No; Part Number: R0402_1K_1%_0.0625W_100PPM; Component Kind: Standard; Component Type: Standard; Pin Count: 2; Value: 1k; Status: Not Recommended; Power: 0.0625W; Manufacturer Part Number: R0402_1K_1%_0.0625W_100PPM; Case: 0402; Mounted: Yes; Sense: No; Socket: No; SMD: Yes; Manufacturer1 Example: YAGEO PHYCOMP; Manufacturer1 ComponentHeight: 0.4mm; HelpURL: \\cern.ch\dfs\Applications\Altium\Datasheets\R0402_Phycomp_RC0402.pdf; Author: CERN DEM JLC; CreateDate: 03.12.2007; LatestRevisionDate: 17.10.2012
R60 R66-R70 = R0402_33R_1%_0.0625W_100PPM: Resistor - 1%; Part Description: General Purpose Thick Film Chip Resistor; Manufacturer: GENERIC; Manufacturer1 Part Number: 232270673309L; TC: ±100ppm/°C; PressFit: No; Part Number: R0402_33R_1%_0.0625W_100PPM; Component Kind: Standard; Component Type: Standard; Pin Count: 2; Value: 33; Status: Not Recommended; Power: 0.0625W; Manufacturer Part Number: R0402_33R_1%_0.0625W_100PPM; Case: 0402; Mounted: Yes; Sense: No; Socket: No; SMD: Yes; Manufacturer1 Example: YAGEO PHYCOMP; Manufacturer1 ComponentHeight: 0.4mm; HelpURL: \\cern.ch\dfs\Applications\Altium\Datasheets\R0402_Phycomp_RC0402.pdf; Author: CERN DEM JLC; CreateDate: 03.12.2007; LatestRevisionDate: 17.10.2012

## Sheet SPEC_A7_Power.SchDoc: Clocker
size 420 x 297 mm; DrawnBy: A.B.; Organization: Wydział Elektroniki i Technik Informacyjnych; Address1: ul. Nowowiejska 15/19; Address2: 00-665 Warszawa; Address3: NSW; Address4: Polska; Revision: 0; SheetNumber: 4; SheetTotal: 5; CreateDate: 20/06/2024; Designer: A.B.; Projet: Spec7; CheckedDate: -; ModifiedBy: -
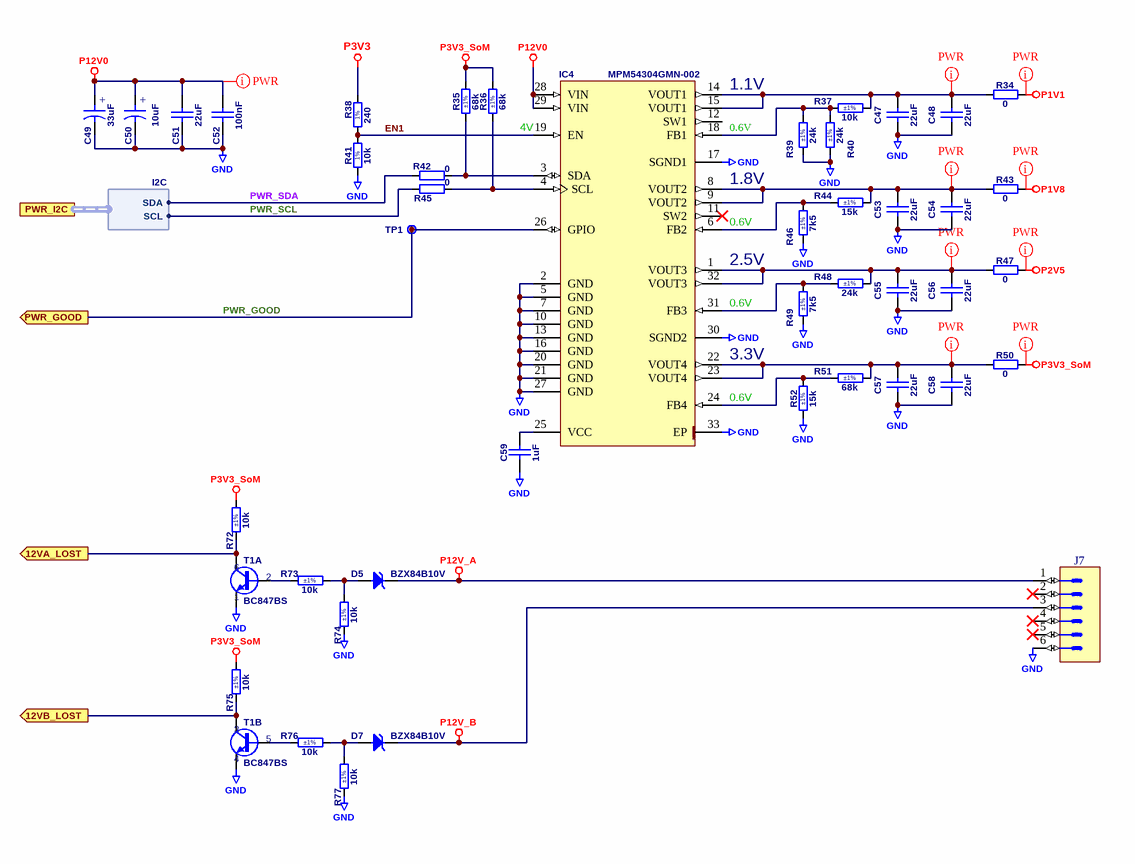
[diagram p3: SPEC_A7_Power.SchDoc]

### Parts
C47  22uF  [CAPC2012X135N]
C48  22uF  [CAPC2012X135N]
C49  33uF  [CAPMP3528X210N]
C50  10uF  [CAPMP3216X180N]
C51  22uF  [CAPC2012X135N]
C52  100nF  [CAPC1005X55N]
C53  22uF  [CAPC2012X135N]
C54  22uF  [CAPC2012X135N]
C55  22uF  [CAPC2012X135N]
C56  22uF  [CAPC2012X135N]
C57  22uF  [CAPC2012X135N]
C58  22uF  [CAPC2012X135N]
C59  1uF  [CAPC1005X55N]
D5  BZX84B10V  [SOT95P248X115-3N]
D7  BZX84B10V  [SOT95P248X115-3N]
IC4  MPM54304GMN-002  [MPS_MPM54304GMN]
J7  Header 6  [3M_N2506-6002RB]  (value not drawn)
R34  0  [RESC2012X60N]
R35  68k  Tolerance: ±1%  [RESC1005X40N]
R36  68k  Tolerance: ±1%  [RESC1005X40N]
R37  10k  Tolerance: ±1%  [RESC1005X40N]
R38  240  [RESC1005X40N]
R39  24k  Tolerance: ±1%  [RESC1005X40N]
R40  24k  Tolerance: ±1%  [RESC1005X40N]
R41  10k  [RESC1005X40N]
R42  0  [RESC1005X40N]
R43  0  [RESC2012X60N]
R44  15k  Tolerance: ±1%  [RESC1005X40N]
R45  0  [RESC1005X40N]
R46  7k5  Tolerance: ±1%  [RESC1005X40N]
R47  0  [RESC2012X60N]
R48  24k  Tolerance: ±1%  [RESC1005X40N]
R49  7k5  Tolerance: ±1%  [RESC1005X40N]
R50  0  [RESC2012X60N]
R51  68k  Tolerance: ±1%  [RESC1005X40N]
R52  15k  Tolerance: ±1%  [RESC1005X40N]
R72  10k  Tolerance: ±1%  [RESC1005X40N]
R73  10k  Tolerance: ±1%  [RESC1005X40N]
R74  10k  Tolerance: ±1%  [RESC1005X40N]
R75  10k  Tolerance: ±1%  [RESC1005X40N]
R76  10k  Tolerance: ±1%  [RESC1005X40N]
R77  10k  Tolerance: ±1%  [RESC1005X40N]
T1  BC847BS  [SOT65P210X110-6N]  (parts A,B of 2)
TP1  Test Point  [TPS127]  (value not drawn)  (no BOM)

### Ports
12VA_LOST (out), 12VB_LOST (out), PWR_GOOD (out), PWR_I2C (harness I2C)

### Harnesses
I2C: SCL, SDA

### Nets
GND: C47.1 C48.1 C49.2 C50.2 C51.1 C52.1 C53.1 C54.1 C55.1 C56.1 C57.1 C58.1 C59.1 IC4.2(GND) IC4.5(GND) IC4.7(GND) IC4.10(GND) IC4.13(GND) IC4.16(GND) IC4.17(SGND1) IC4.20(GND) IC4.21(GND) IC4.27(GND) IC4.30(SGND2) IC4.33(EP) J7.6 R39.1 R40.1 R41.1 R46.1 R49.1 R52.1 R74.1 R77.1 T1.1(E) T1.4(E)
P1V1: R34.2
P1V8: R43.2
P2V5: R47.2
P3V3: R38.2
P3V3_SoM: R35.2 R36.2 R50.2 R72.2 R75.2
P12V0: C49.1 C50.1 C51.2 C52.2 IC4.28(VIN) IC4.29(VIN)
P12V_A: D5.3(C) J7.1
P12V_B: D7.3(C) J7.3
EN1: IC4.19(EN) R38.1 R41.2
GPIO112: R72.1 T1.6(C) ; port 12VA_LOST
GPIO114: R75.1 T1.3(C) ; port 12VB_LOST
PWR_GOOD: IC4.26(GPIO) TP1.1 ; port PWR_GOOD
PWR_SCL: R45.1 ; port PWR_I2C.SCL  [project net I2CB_SCL]
PWR_SDA: R42.1 ; port PWR_I2C.SDA  [project net I2CB_SDA]
NetC47_2: C47.2 C48.2 IC4.14(VOUT1) IC4.15(VOUT1) R34.1 R37.2
NetC53_2: C53.2 C54.2 IC4.8(VOUT2) IC4.9(VOUT2) R43.1 R44.2
NetC55_2: C55.2 C56.2 IC4.1(VOUT3) IC4.32(VOUT3) R47.1 R48.2
NetC57_2: C57.2 C58.2 IC4.22(VOUT4) IC4.23(VOUT4) R50.1 R51.2
NetC59_2: C59.2 IC4.25(VCC)
NetD5_1: D5.1(A) R73.2 R74.2
NetD7_1: D7.1(A) R76.2 R77.2
NetIC4_3: IC4.3(SDA) R35.1 R42.2
NetIC4_4: IC4.4(SCL) R36.1 R45.2
NetIC4_6: IC4.6(FB2) R44.1 R46.2
NetIC4_18: IC4.18(FB1) R37.1 R39.2 R40.2
NetIC4_24: IC4.24(FB4) R51.1 R52.2
NetIC4_31: IC4.31(FB3) R48.1 R49.2
NetR73_1: R73.1 T1.2(B)
NetR76_1: R76.1 T1.5(B)

Not connected (* = marked no-connect by the designer): IC4 11(SW2)* 12(SW1); J7 2* 4* 5*

### Layout directives
net class PWR: NetC47_2, NetC53_2, NetC55_2, NetC57_2, P1V1, P1V8, P2V5, P3V3_SoM, P12V0

### Notes on the sheet
- 1.1V
- 4V
- 0.6V
- 1.8V
- 2.5V
- 3.3V
- Project/Equipment
- Document
- Designer
- Drawn by
- Check.by
- Copyright WUT ISE 2024.
  This documentation describes Open Hardware and is licensed under the CERN OHL v.2. You may redistribute and modify this documentation under the terms of the CERN OHL v.2. (http://ohwr.org/CERNOHL). This documentation is distributed WITHOUT ANY EXPRESS OR IMPLIED WARRANTY, INCLUDING OF MERCHANTABILITY, SATISFACTORY QUALITY AND FITNESS FOR A PARTICULAR PURPOSE. Please see the CERN OHL v.2 for applicable conditions.
- Contact
- File
- Last Mod.
- Print Date
- Sheet
- Size
- A3
- of
- Rev
- (in symbol CTE3216-18_10UF_16V_20%_AVX_TCJ) +
- (in symbol CTE3528-21_33UF_16V_10%) +
- (in symbol R0402_10K_1%_0.0625W_100PPM) 1%
- (in symbol R0402_240R_1%_0.0625W_100PPM) 1%

### Library data of the parts
C47 C48 C51 C53-C58 = CC0805_22UF_16V_10%_X5R: as C32 on sheet ETH_PHY_SFP; Manufacturer Part Number: CC0805_22UF_16V_10%_X5R; Part Number: CC0805_22UF_16V_10%_X5R; Value: 22uF; Component Kind: Standard; Component Type: Standard; Pin Count: 2; Status: Preferred; Case: 0805; Mounted: Yes; Socket: No; SMD: Yes; Sense: No; Manufacturer1 Example: TDK; Manufacturer1 ComponentHeight: 1.35mm; HelpURL: \\cern.ch\dfs\Applications\Altium\Datasheets\CC0805_X5R_TDK_C.pdf; Author: CERN DEM JLC; CreateDate: 25.10.2012; LatestRevisionDate: 25.10.2012
C49 = CTE3528-21_33UF_16V_10%: Polarised capacitor; Part Description: Solid Tantalum Chip Capacitor; Manufacturer: GENERIC; Manufacturer1 Part Number: TAJB336K016R; Voltage: 16V; Tolerance: ±10%; Part Number: CTE3528-21_33UF_16V_10%; Component Kind: Standard; Component Type: Standard; Pin Count: 2; Value: 33uF; Status: Preferred; Manufacturer Part Number: CTE3528-21_33UF_16V_10%; Case: B; Mounted: Yes; Socket: No; SMD: Yes; Sense: No; HelpURL: \\cern.ch\dfs\Applications\Altium\Datasheets\CTE_AVX_TAJ.pdf; Author: CERN DEM JLC; CreateDate: 03.12.2007; LatestRevisionDate: 03.12.2007; Manufacturer1 Example: AVX; Manufacturer1 ComponentHeight: 2.1mm
C50 = CTE3216-18_10UF_16V_20%_AVX_TCJ: Polarised capacitor; Part Description: ESR 0R200 Tantalum Solid Electrolytic Chip Capacitor with Conductive Polymer Electrode; Manufacturer: AVX; Manufacturer Part Number: TCJA106M016R0200; Voltage: 16V; Tolerance: ±20%; Part Number: CTE3216-18_10UF_16V_20%_AVX_TCJ; Component Kind: Standard; Component Type: Standard; Pin Count: 2; Value: 10uF; Status: Preferred; Case: A; Mounted: Yes; Socket: No; SMD: Yes; Sense: No; ComponentHeight: 1.8mm; HelpURL: \\cern.ch\dfs\Applications\Altium\Datasheets\CTE_AVX_TCJ.pdf; Author: CERN DEM JLC; CreateDate: 29.03.2012; LatestRevisionDate: 29.03.2012
C52 = CC0402_100NF_16V_10%_X7R: as C1 on sheet ETH_PHY_SFP; Part Number: CC0402_100NF_16V_10%_X7R; Component Kind: Standard; Component Type: Standard; Pin Count: 2; Value: 100nF; Status: Not Recommended; Manufacturer Part Number: CC0402_100NF_16V_10%_X7R; Case: 0402; Mounted: Yes; Socket: No; SMD: Yes; Sense: No; Manufacturer1 Example: MURATA; Manufacturer1 ComponentHeight: 0.55mm; HelpURL: \\cern.ch\dfs\Applications\Altium\Datasheets\CC0402_X7R_MURATA_GRM.pdf; Author: CERN DEM JLC; CreateDate: 05/12/2013; LatestRevisionDate: 03/12/2007
C59 = CC0402_1UF_16V_10%_X5R: as C12 on sheet ETH_PHY_SFP; Part Number: CC0402_1UF_16V_10%_X5R; Component Kind: Standard; Component Type: Standard; Pin Count: 2; Value: 1uF; Status: Preferred; Manufacturer Part Number: CC0402_1UF_16V_10%_X5R; Case: 0402; Mounted: Yes; Socket: No; SMD: Yes; Sense: No; Manufacturer1 Example: TDK; Manufacturer1 ComponentHeight: 0.55mm; HelpURL: \\cern.ch\dfs\Applications\Altium\Datasheets\CC0402_X5R_TDK_C.pdf; Author: CERN DEM JLC; CreateDate: 25.10.2012; LatestRevisionDate: 25.10.2012
D5 D7 = BZX84B10V: Diode Zener Anode Pin 1 Cathode Pin 3 (Pas de pin 2); Part Description: Small Signal Zener Diode; Manufacturer: VISHAY SEMICONDUCTORS; Voltage: 10V; Power: 300mW; PressFit: No; Bonding: No; Part Number: BZX84B10V; Component Kind: Standard; Component Type: Standard; Device: BZX84B10V; PackageDescription: SOT, 0.95mm Pitch; 3 Pin, 1.315mm W X 2.95mm L X 1.15mm H body, IPC Medium Density; Manufacturer Part Number: BZX84B10V; Pin Count: 2; Case: SOT23-3; Mounted: Yes; Socket: No; SMD: Yes; Sense: No; ComponentHeight: 1.15mm; HelpURL: \\cern.ch\dfs\Applications\Altium\Datasheets\BZX84B10V.pdf; Author: CERN DEM JLC; CreateDate: 23.10.2013; LatestRevisionDate: 23.10.2013
IC4 = MPM54304GMN-XXXX: Quad-Output Power Module with I2C and MTP; Part Description: 4V to 16V Input, Quad-Output Power Module with I2C and MTP; Manufacturer: MPS (MONOLITIC  POWER SYSTEMS); PressFit: No; Bonding: No; Part Number: MPM54304GMN-002; Component Kind: Standard; Component Type: Standard; Device: MPM54304GMN-002; PackageDescription: MPS LGA-33 Case, 0.65mm Pitch, Rect.; 32 Pin, 7.00mm L X 7.00mm W X 2.10mm H body (w/Thermal Tab 3.55 X 3.55mm); Manufacturer Part Number: MPM54304GMN-002; Pin Count: 33; Case: QFN32; Mounted: Yes; Socket: No; SMD: Yes; Sense: No; ComponentHeight: 2.1mm; HelpURL: \\cern.ch\dfs\Applications\Altium\Datasheets\MPM54304GMN.pdf; Author: CERN DEM BC; CreateDate: 09.11.2020; LatestRevisionDate: 23.11.2022
J7 = 3M_N2506-6002RB: Connector 6 Male; Part Description: 6 Contacts, Straight .100'' x .100'' Low Profile Four-Wall Header, (Solder Tail 2.84mm), 2500 Series; Manufacturer: 3M; PressFit: No; Part Number: 3M_N2506-6002RB; Component Kind: Standard; Component Type: Standard; Pin Count: 6; Family: Header 6; Mounted: Yes; Socket: No; SMD: No; Sense: No; Status: None; Manufacturer Part Number: N2506-6002RB; ComponentHeight: 9.91mm; HelpURL: \\cern.ch\dfs\Applications\Altium\Datasheets\3M_N2506-6002RB.pdf; Author: CERN DEM JLC; CreateDate: 19.04.2018; LatestRevisionDate: 19.04.2018
R34 R43 R47 R50 = R0805_0R_JUMPER: Resistor; Part Description: 2A (0.05R Max DC Resistance) Zero Ohm Jumper; Manufacturer: GENERIC; Manufacturer1 Part Number: NRC10Z0; PressFit: No; Part Number: R0805_0R_JUMPER; Component Kind: Standard; Component Type: Standard; Pin Count: 2; Value: 0; Status: Preferred; Manufacturer Part Number: R0805_0R_JUMPER; Case: 0805; Mounted: Yes; Sense: No; Socket: No; SMD: Yes; Manufacturer1 Example: NIC COMPONENT; Manufacturer1 ComponentHeight: 0.6mm; HelpURL: \\cern.ch\dfs\Applications\Altium\Datasheets\R0805_NIC_NRC.pdf; Author: CERN DEM JLC; CreateDate: 03.12.2007; LatestRevisionDate: 13.03.2008
R35 R36 R51 = R0402_68K_1%_0.0625W_100PPM: Resistor - 1%; Part Description: General Purpose Thick Film Chip Resistor; Manufacturer: GENERIC; Manufacturer1 Part Number: 232270676803L; TC: ±100ppm/°C; PressFit: No; Part Number: R0402_68K_1%_0.0625W_100PPM; Component Kind: Standard; Component Type: Standard; Pin Count: 2; Value: 68k; Status: Not Recommended; Power: 0.0625W; Manufacturer Part Number: R0402_68K_1%_0.0625W_100PPM; Case: 0402; Mounted: Yes; Sense: No; Socket: No; SMD: Yes; Manufacturer1 Example: YAGEO PHYCOMP; Manufacturer1 ComponentHeight: 0.4mm; HelpURL: \\cern.ch\dfs\Applications\Altium\Datasheets\R0402_Phycomp_RC0402.pdf; Author: CERN DEM JLC; CreateDate: 03.12.2007; LatestRevisionDate: 17.10.2012
R37 R41 R72-R77 = R0402_10K_1%_0.0625W_100PPM: as R2 on sheet ETH_PHY_SFP; Part Number: R0402_10K_1%_0.0625W_100PPM; Component Kind: Standard; Component Type: Standard; Pin Count: 2; Value: 10k; Status: Not Recommended; Power: 0.0625W; Manufacturer Part Number: R0402_10K_1%_0.0625W_100PPM; Case: 0402; Mounted: Yes; Sense: No; Socket: No; SMD: Yes; Manufacturer1 Example: YAGEO PHYCOMP; Manufacturer1 ComponentHeight: 0.4mm; HelpURL: \\cern.ch\dfs\Applications\Altium\Datasheets\R0402_Phycomp_RC0402.pdf; Author: CERN DEM JLC; CreateDate: 03.12.2007; LatestRevisionDate: 17.10.2012
  R41: Tolerance: ±1%
R38 = R0402_240R_1%_0.0625W_100PPM: as R1 on sheet ETH_PHY_SFP; Part Number: R0402_240R_1%_0.0625W_100PPM; Component Kind: Standard; Component Type: Standard; Pin Count: 2; Value: 240; Status: Not Recommended; Power: 0.0625W; Tolerance: ±1%; Manufacturer Part Number: R0402_240R_1%_0.0625W_100PPM; Case: 0402; Mounted: Yes; Sense: No; Socket: No; SMD: Yes; Manufacturer1 Example: YAGEO PHYCOMP; Manufacturer1 ComponentHeight: 0.4mm; HelpURL: \\cern.ch\dfs\Applications\Altium\Datasheets\R0402_Phycomp_RC0402.pdf; Author: CERN DEM JLC; CreateDate: 03.12.2007; LatestRevisionDate: 17.10.2012
R39 R40 R48 = R0402_24K_1%_0.0625W_100PPM: Resistor - 1%; Part Description: General Purpose Thick Film Chip Resistor; Manufacturer: GENERIC; Manufacturer1 Part Number: 232270672403L; TC: ±100ppm/°C; PressFit: No; Part Number: R0402_24K_1%_0.0625W_100PPM; Component Kind: Standard; Component Type: Standard; Pin Count: 2; Value: 24k; Status: Not Recommended; Power: 0.0625W; Manufacturer Part Number: R0402_24K_1%_0.0625W_100PPM; Case: 0402; Mounted: Yes; Sense: No; Socket: No; SMD: Yes; Manufacturer1 Example: YAGEO PHYCOMP; Manufacturer1 ComponentHeight: 0.4mm; HelpURL: \\cern.ch\dfs\Applications\Altium\Datasheets\R0402_Phycomp_RC0402.pdf; Author: CERN DEM JLC; CreateDate: 03.12.2007; LatestRevisionDate: 17.10.2012
R42 R45 = R0402_0R_JUMPER: as R9 on sheet ETH_PHY_SFP; Part Number: R0402_0R_JUMPER; Component Kind: Standard; Component Type: Standard; Pin Count: 2; Value: 0; Status: Not Recommended; Manufacturer Part Number: R0402_0R_JUMPER; Case: 0402; Mounted: Yes; Sense: No; Socket: No; SMD: Yes; Manufacturer1 Example: YAGEO PHYCOMP; Manufacturer1 ComponentHeight: 0.4mm; HelpURL: \\cern.ch\dfs\Applications\Altium\Datasheets\R0402_Phycomp_RC0402.pdf; Author: CERN DEM JLC; CreateDate: 03.12.2007; LatestRevisionDate: 17.10.2012
R44 R52 = R0402_15K_1%_0.0625W_100PPM: Resistor - 1%; Part Description: General Purpose Thick Film Chip Resistor; Manufacturer: GENERIC; Manufacturer1 Part Number: CRCW040215K0FK; TC: ±100ppm/°C; PressFit: No; Part Number: R0402_15K_1%_0.0625W_100PPM; Component Kind: Standard; Component Type: Standard; Pin Count: 2; Value: 15k; Status: Preferred; Power: 0.0625W; Manufacturer Part Number: R0402_15K_1%_0.0625W_100PPM; Case: 0402; Mounted: Yes; Sense: No; Socket: No; SMD: Yes; Manufacturer1 Example: VISHAY; Manufacturer1 ComponentHeight: 0.4mm; HelpURL: \\cern.ch\dfs\Applications\Altium\Datasheets\R0402_VISHAY_CRCW e3.pdf; Author: CERN DEM JMW; CreateDate: 06.07.2015; LatestRevisionDate: 06.07.2015
R46 R49 = R0402_7K5_1%_0.0625W_100PPM: Resistor - 1%; Part Description: General Purpose Thick Film Chip Resistor; Manufacturer: GENERIC; Manufacturer1 Part Number: 232270677502L; TC: ±100ppm/°C; PressFit: No; Part Number: R0402_7K5_1%_0.0625W_100PPM; Component Kind: Standard; Component Type: Standard; Pin Count: 2; Value: 7k5; Status: Not Recommended; Power: 0.0625W; Manufacturer Part Number: R0402_7K5_1%_0.0625W_100PPM; Case: 0402; Mounted: Yes; Sense: No; Socket: No; SMD: Yes; Manufacturer1 Example: YAGEO PHYCOMP; Manufacturer1 ComponentHeight: 0.4mm; HelpURL: \\cern.ch\dfs\Applications\Altium\Datasheets\R0402_Phycomp_RC0402.pdf; Author: CERN DEM JLC; CreateDate: 03.12.2007; LatestRevisionDate: 17.10.2012
T1 = BC847BS: 45V, 100mA Dual NPN General-Purpose Transistor; Part Description: 45V 100mA Dual NPN General-Purpose Transistor; Manufacturer: NXP SEMICONDUCTORS; PressFit: No; Bonding: No; Part Number: BC847BS; Component Kind: Standard; Component Type: Standard; Device: BC847BS; PackageDescription: SOT363, SC-88, 0.65mm Pitch; 6 Pin, 1.25mm W X 2.00mm L X 1.10mm H body, IPC Medium Density; Manufacturer Part Number: BC847BS; Pin Count: 6; Case: SOT363; Mounted: Yes; Socket: No; SMD: Yes; Sense: No; ComponentHeight: 1.1mm; HelpURL: \\cern.ch\dfs\Applications\Altium\Datasheets\BC847BS.pdf; Author: CERN DEM JMW; CreateDate: 10.07.2015; LatestRevisionDate: 10.07.2015
TP1 = SMD_PAD_1.27X1.27MM: Part Description: 1.27mm x 1.27mm PCB Copper Area (SMD Test Point); Mounted: No; Part Number: SMD_PAD_1.27X1.27MM; Component Type: Standard (No BOM); Pin Count: 1; Family: Test Point; Socket: No; SMD: Yes; Sense: No; Status: None; ComponentHeight: 0mm; HelpURL: Undefined; Author: CERN DEM JLC; CreateDate: 12.01.2008; LatestRevisionDate: 12.01.2008; PackageDescription: 1.27mm x 1.27mm PCB Copper Area (SMD Test Point)